# Altium schematic sheet LD-ShouShi-V1.7.schdoc
size A4
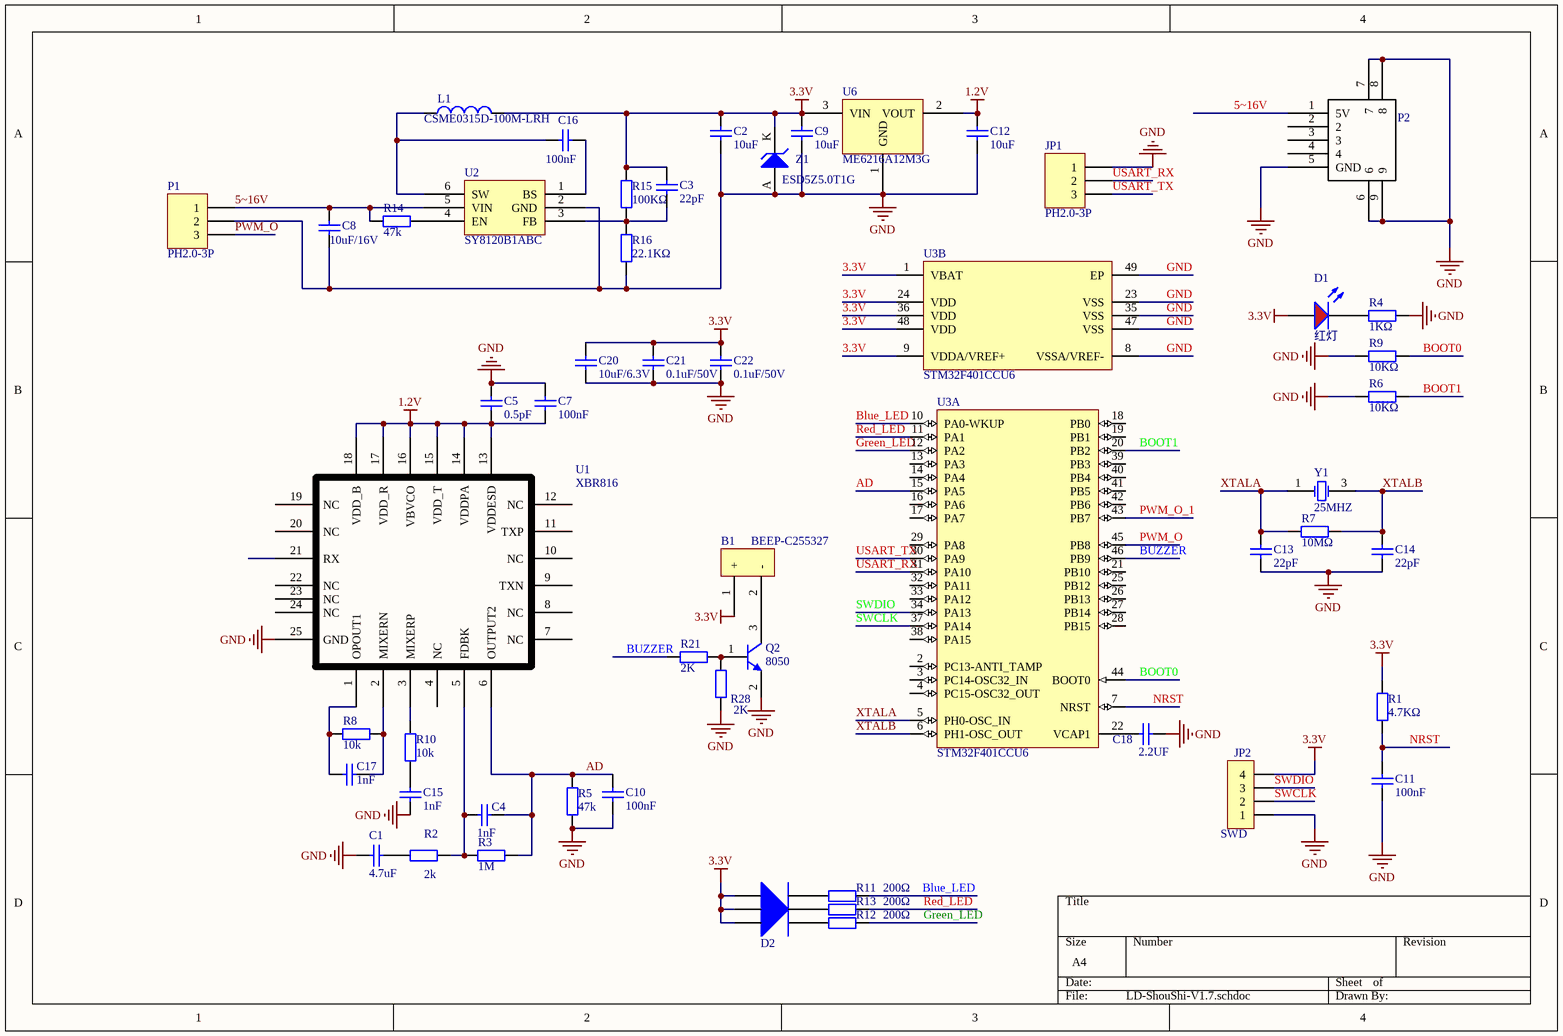
[diagram p0: LD-ShouShi-V1.7.schdoc]

## Parts
B1  BEEP-C255327  [C255327-Beep]
C1  4.7uF  [C0402]
C2  10uF  [LC-0402_C]
C3  22pF  [LC-0402_C]
C4  1nF  [C0402]
C5  0.5pF  [C0402]
C7  100nF  [C0402]
C8  10uF/16V  [C0805]
C9  10uF  [LC-0402_C]
C10  100nF  [C0402]
C11  100nF  [LC-0402_C]
C12  10uF  [LC-0402_C]
C13  22pF  [LC-0402_C]
C14  22pF  [LC-0402_C]
C15  1nF  [C0402]
C16  100nF  [C0402]
C17  1nF  [C0402]
C18  2.2UF  [LC-0402_C]
C20  10uF/6.3V  [LC-0402_C]
C21  0.1uF/50V  [LC-0402_C]
C22  0.1uF/50V  [LC-0402_C]
D1  红灯  [LC-0603_LED_S1]
D2  led三色共阴极灯  [三色灯]  (value not drawn)
JP1  PH2.0-3P  [1X3-2.54]
JP2  SWD  [SIP4-2.54]
L1  CSME0315D-100M-LRH  [PRS3015]
P1  PH2.0-3P  [PH2.0-3P]
P2  MINIUSB  [miniusb]  (value not drawn)
Q2  8050  [SOT-23]
R1  4.7KΩ  [LC-0402_R]
R2  2k  [R0402]
R3  1M  [R0402]
R4  1KΩ  [LC-0402_R]
R5  47k  [R0402]
R6  10KΩ  [LC-0402_R]
R7  10MΩ  [LC-0402_R]
R8  10k  [R0402]
R9  10KΩ  [LC-0402_R]
R10  10k  [R0402]
R11  200Ω  [LC-0402_R]
R12  200Ω  [LC-0402_R]
R13  200Ω  [LC-0402_R]
R14  47k  [R0402]
R15  100KΩ  [LC-0402_R]
R16  22.1KΩ  [LC-0402_R]
R21  2K  [R0402]
R28  2K  [R0402]
U1  XBR816  [QFN24-1]
U2  SY8120B1ABC  [SOT23-6]
U3  STM32F401CCU6  [UFQFPN-48_L7.0-W7.0-P0.50-BL-EP]  (parts A,B of 2)
U6  ME6216A12M3G  [SOT-23]
Y1  25MHZ  [OSC-SMD_4P-L2.0-W1.6-BL]
Z1  ESD5Z5.0T1G  [SOD523]

## Nets
1.2V: C5.1 C7.1 C12.2 U1.13(VDDESD) U1.14(VDDPA) U1.15(VDD_T) U1.16(VBVCO) U1.17(VDD_R) U1.18(VDD_B) U6.2(VOUT)
3.3V: B1.1(+) C2.2 C3.2 C9.2 C20.2 C21.2 C22.2 D1.A D2.1(A+) D2.2(B+) D2.3(C+) JP2.4 L1.2 R1.2 R15.2 U3.1(VBAT) U3.9(VDDA/VREF+) U3.24(VDD) U3.36(VDD) U3.48(VDD) U6.3(VIN) Z1.K
GND: C1.2 C2.1 C5.2 C7.2 C8.2 C9.1 C10.2 C11.1 C12.1 C13.1 C14.1 C15.1 C18.2 C20.1 C21.1 C22.1 JP1.1 JP2.1 P1.2 P2.5(GND) P2.6 P2.7 P2.8 P2.9 Q2.2(E) R4.1 R5.2 R6.1 R9.1 R16.2 R28.1 U1.25(GND) U2.2(GND) U3.8(VSSA/VREF-) U3.23(VSS) U3.35(VSS) U3.47(VSS) U3.49(EP) U6.1(GND) Z1.A
5~16V: C8.1 P1.1 P2.1(5V) R14.2 U2.5(VIN)
AD: C4.1 C10.1 R3.1 R5.1 U1.6(OUTPUT2) U3.15(PA5)
Blue_LED: R11.2 U3.10(PA0-WKUP)
BOOT0: R9.2 U3.44(BOOT0)
BOOT1: R6.2 U3.20(PB2)
BUZZER: R21.1 U3.46(PB9)
Green_LED: R12.2 U3.12(PA2)
NRST: C11.2 R1.1 U3.7(NRST)
PWM_O: P1.3 U3.45(PB8)
PWM_O_1: U3.43(PB7)
Red_LED: R13.2 U3.11(PA1)
SWCLK: JP2.2 U3.37(PA14)
SWDIO: JP2.3 U3.34(PA13)
USART_RX: JP1.2 U3.31(PA10)
USART_TX: JP1.3 U3.30(PA9)
XTALA: C13.2 R7.1 U3.5(PH0-OSC_IN) Y1.1(OSC1)
XTALB: C14.2 R7.2 U3.6(PH1-OSC_OUT) Y1.3(OSC2)
NetB1_2: B1.2(-) Q2.3(C)
NetC1_1: C1.1 R2.1
NetC3_1: C3.1 R15.1 R16.1 U2.3(FB)
NetC4_2: C4.2 R2.2 R3.2 U1.5(FDBK)
NetC15_2: C15.2 R10.2
NetC16_1: C16.1 L1.1 U2.6(SW)
NetC16_2: C16.2 U2.1(BS)
NetC17_1: C17.1 R8.1 U1.2(MIXERN)
NetC17_2: C17.2 R8.2 U1.1(OPOUT1)
NetC18_1: C18.1 U3.22(VCAP1)
NetD1_K: D1.K R4.2
NetD2_4: D2.4(A-) R11.1
NetD2_5: D2.5(B-) R13.1
NetD2_6: D2.6(C-) R12.1
NetQ2_1: Q2.1(B) R21.2 R28.2
NetR10_1: R10.1 U1.3(MIXERP)
NetR14_1: R14.1 U2.4(EN)

Not connected (* = marked no-connect by the designer): P2 2 3 4; U1 4(NC) 7(NC) 8(NC) 9(TXN) 10(NC) 11(TXP) 12(NC) 19(NC) 20(NC) 21(RX) 22(NC) 23(NC) 24(NC); U3 2(PC13-ANTI_TAMP) 3(PC14-OSC32_IN) 4(PC15-OSC32_OUT) 13(PA3) 14(PA4) 16(PA6) 17(PA7) 18(PB0) 19(PB1) 21(PB10) 25(PB12) 26(PB13) 27(PB14) 28(PB15) 29(PA8) 32(PA11) 33(PA12) 38(PA15) 39(PB3) 40(PB4) 41(PB5) 42(PB6)

## Library data of the parts
B1 = BEEP
C1 C4 C5 C7 C8 C10 C15-C17 = Cap: Capacitor; Published: 8-Jun-2000; LatestRevisionDate: 17-Jul-2002; LatestRevisionNote: Re-released for DXP Platform.; PackageReference: RAD-0.3; Publisher: Altium Limited; PackageDescription: Radial Cap, Thru-Hole; 2 Leads; 0.3 in Pin Spacing
  C1: Value: 4.7uF
  C4 C15 C17: Value: 1nF
  C5: Value: 0.5pF
  C7 C10 C16: Value: 100nF
  C8: Value: 10uF/16V
C2 C9 C12 C20-C22 = 0402 10uF (106) 20% 6.3V: 贴片电容; ComponentLink1Description: 供应商链接; ComponentLink1URL: http://www.szlcsc.com/product/details_16204.html; Package: 0402; Supplier: LC; SuppliersPartNumber: C15525
C3 C13 C14 = 0402 22pF (220) 5% 50V: 贴片电容; ComponentLink1Description: 供应商链接; ComponentLink1URL: http://www.szlcsc.com/product/details_1907.html; Package: 0402; Supplier: LC; SuppliersPartNumber: C1555
C11 = 0402 100nF (104) 10% 16V: 贴片电容; ComponentLink1Description: 供应商链接; ComponentLink1URL: http://www.szlcsc.com/product/details_1877.html; Package: 0402; Supplier: LC; SuppliersPartNumber: C1525
C18 = 0402 2.2nF (222) 10% 50V: 贴片电容; ComponentLink1Description: 供应商链接; ComponentLink1URL: http://www.szlcsc.com/product/details_1883.html; Package: 0402; Supplier: LC; SuppliersPartNumber: C1531
D1 = 0603 红灯: 发光二极管; ComponentLink1Description: 供应商链接; ComponentLink1URL: http://www.szlcsc.com/product/details_2659.html; Package: 0603; Supplier: LC; SuppliersPartNumber: C2286
JP1 P1 = Header 3: Header, 3-Pin; LatestRevisionDate: 17-Jul-2002; LatestRevisionNote: Re-released for DXP Platform.; Publisher: Altium Limited
JP2 = Header 4: 4P接插件; 版权归属: 源创客; BOM名称: 4P接插件; 学习资源: www.ooocke.com
L1 = Inductor: Code_IEC: 1005; Published: 8-Jun-2000; LatestRevisionDate: 29-May-2009; LatestRevisionNote: IPC-7351 Footprint Added.; PackageReference: 0402-A; Publisher: Altium Limited; PackageDescription: Chip Inductor; Code_JEITA: 0402; Value: CSME0315D-100M-LRH
P2 = MINIUSB-M
Q2 = 2N3904: NPN General Purpose Amplifier; Published: 8-Jun-2000; LatestRevisionDate: 15-Jan-2003; LatestRevisionNote: PCB Footprint 'BCY-W3/D4.7' replaced; DatasheetVersion: 1997; PackageVersion: Sep-1998; PackageReference: TO-92A; Publisher: Altium Limited; PackageDescription: TO, Flat Index; 3 In-Line, Axial Leads; Body Dia. 4.5mm; Leads 0.51 x 0.48 mm (max); ComponentLink1Description: Manufacturer Link; ComponentLink1URL: http://www.fairchildsemi.com/; ComponentLink2Description: Datasheet; ComponentLink2URL: http://www.fairchildsemi.com/ds/2N%2F2N3904.pdf; Value: 8050
R1 = 0402 4.7KΩ (4701) 1%: 贴片电阻; ComponentLink1Description: 供应商链接; ComponentLink1URL: http://www.szlcsc.com/product/details_26643.html; Package: 0402; Supplier: LC; SuppliersPartNumber: C25900
R2 R3 R5 R8 R10 R14 = Res2: Resistor; Published: 8-Jun-2000; LatestRevisionDate: 17-Jul-2002; LatestRevisionNote: Re-released for DXP Platform.; PackageReference: AXIAL-0.4; Publisher: Altium Limited; PackageDescription: Axial Device, Thru-Hole; 2 Leads; 0.4 in Pin Spacing
  R2: Value: 2k
  R3: Value: 1M
  R5 R14: Value: 47k
  R8 R10: Value: 10k
R4 = 0402 1KΩ (1001) 1%: 贴片电阻; ComponentLink1Description: 供应商链接; ComponentLink1URL: http://www.szlcsc.com/product/details_12256.html; Package: 0402; Supplier: LC; SuppliersPartNumber: C11702
R6 R9 = 0402 10KΩ (1002) 1%: 贴片电阻; ComponentLink1Description: 供应商链接; ComponentLink1URL: http://www.szlcsc.com/product/details_26487.html; Package: 0402; Supplier: LC; SuppliersPartNumber: C25744
R7 = 0402 10MΩ (1005) 1%: 贴片电阻; ComponentLink1Description: 供应商链接; ComponentLink1URL: http://www.szlcsc.com/product/details_26825.html; Package: 0402; Supplier: LC; SuppliersPartNumber: C26082
R11-R13 = 0402 200Ω (2000) 1%: 贴片电阻; ComponentLink1Description: 供应商链接; ComponentLink1URL: http://www.szlcsc.com/product/details_25830.html; Package: 0402; Supplier: LC; SuppliersPartNumber: C25087
R15 = 0402 100KΩ (1003) 1%: 贴片电阻; ComponentLink1Description: 供应商链接; ComponentLink1URL: http://www.szlcsc.com/product/details_26484.html; Package: 0402; Supplier: LC; SuppliersPartNumber: C25741
R16 = 0402 22KΩ (2202) 1%: 贴片电阻; ComponentLink1Description: 供应商链接; ComponentLink1URL: http://www.szlcsc.com/product/details_26511.html; Package: 0402; Supplier: LC; SuppliersPartNumber: C25768
R21 R28 = Res2: Resistor; Value: 20k; Published: 8-Jun-2000; LatestRevisionDate: 17-Jul-2002; LatestRevisionNote: Re-released for DXP Platform.; PackageReference: AXIAL-0.4; Publisher: Altium Limited
U1 = XBR1000_24_1
U2 = H9108
U3 = STM32F401CCU6: ARM Cortex-M4 32-bit MCU+FPU, 105 DMIPS, 256 kB Flash, 64 kB Internal RAM, 36 I/Os, 48-pin UFQFPN, -40 to 85 degC, Tray; Manufacturer: STMicroelectronics; FLASH Size (Prog) (kB): 256; I/Os (High Current): 36; Internal RAM Size (kB): 64; Operating Frequency(F) (Processor speed) (MHz): 84; Supply Voltage(Vcc) max (V): 3.6; Supply Voltage(Vcc) min (V): 1.8; DatasheetVersion: Rev. 1; PackageVersion: Rev. 1, 04/2013; PackageReference: UFQFPN48; PackageDescription: 48-Pin Ultra Thin Fine Pitch Quad Flat No-Lead, 7 x 7 x 0.6 mm Body, 0.5 mm Pitch, Exposed Pad; Supplier 1: Newark; Supplier Part Number 1: 19X6217; Supplier 2: Mouser; Supplier Part Number 2: 511-STM32F401CCU6; Core: ARM Cortex-M4; Packing: Tray; Mounting Technology: Surface Mount; PartNumber: STM32F401CCU6; ComponentLink1Description: Manufacturer URL; ComponentLink1URL: http://www.st.com/web/en/home.html; ComponentLink2Description: Datasheet; ComponentLink2URL: http://www.st.com/st-web-ui/static/active/en/resource/technical/document/data_brief/DM00071938.pdf; ComponentLink3Description: Package Specification; ComponentLink3URL: http://www.st.com/st-web-ui/static/active/en/resource/technical/document/data_brief/DM00071938.pdf
U6 = SSP6206
Y1 = SMD-3225_4P  25MHZ 12PF 10PPM: 贴片晶振; ComponentLink1Description: 供应商链接; ComponentLink1URL: http://www.szlcsc.com/product/details_9526.html; Package: SMD-3225_4P; Supplier: LC; SuppliersPartNumber: C9006
Z1 = D Zener: Zener Diode; Published: 8-Jun-2000; LatestRevisionDate: 17-Jul-2002; LatestRevisionNote: Re-released for DXP Platform.; PackageReference: DIODE-0.7; Publisher: Altium Limited; PackageDescription: Diode, Thru-Hole; 2 Leads; 0.7 in Pin Spacing